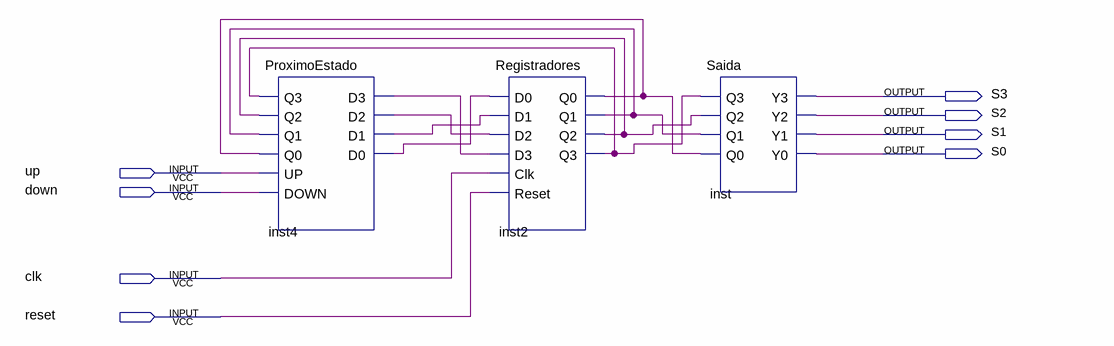
[diagram p0: schematic sheet]
// Quartus schematic MaquinaEstados.bdf as structural Verilog: 3 symbols, 8 pins
module MaquinaEstados (
  input  up,
  input  down,
  input  clk,
  input  reset,
  output S3,
  output S2,
  output S1,
  output S0
);

  wire inst2_q0, inst2_q1, inst2_q2, inst2_q3, inst4_d0, inst4_d1, inst4_d2, inst4_d3;

  ProximoEstado inst4 (
    .Q3(inst2_q3), .Q2(inst2_q2), .Q1(inst2_q1), .Q0(inst2_q0), .UP(up), .DOWN(down), .D3(inst4_d3),
    .D2(inst4_d2), .D1(inst4_d1), .D0(inst4_d0));
  Registradores inst2 (
    .D0(inst4_d0), .D1(inst4_d1), .D2(inst4_d2), .D3(inst4_d3), .Clk(clk), .Reset(reset), .Q0(inst2_q0),
    .Q1(inst2_q1), .Q2(inst2_q2), .Q3(inst2_q3));
  Saida inst (.Q3(inst2_q3), .Q2(inst2_q2), .Q1(inst2_q1), .Q0(inst2_q0), .Y3(S3), .Y2(S2), .Y1(S1), .Y0(S0));
endmodule
